# EasyEDA Pro project EasyEDA-Project.epro, board PCB2_4
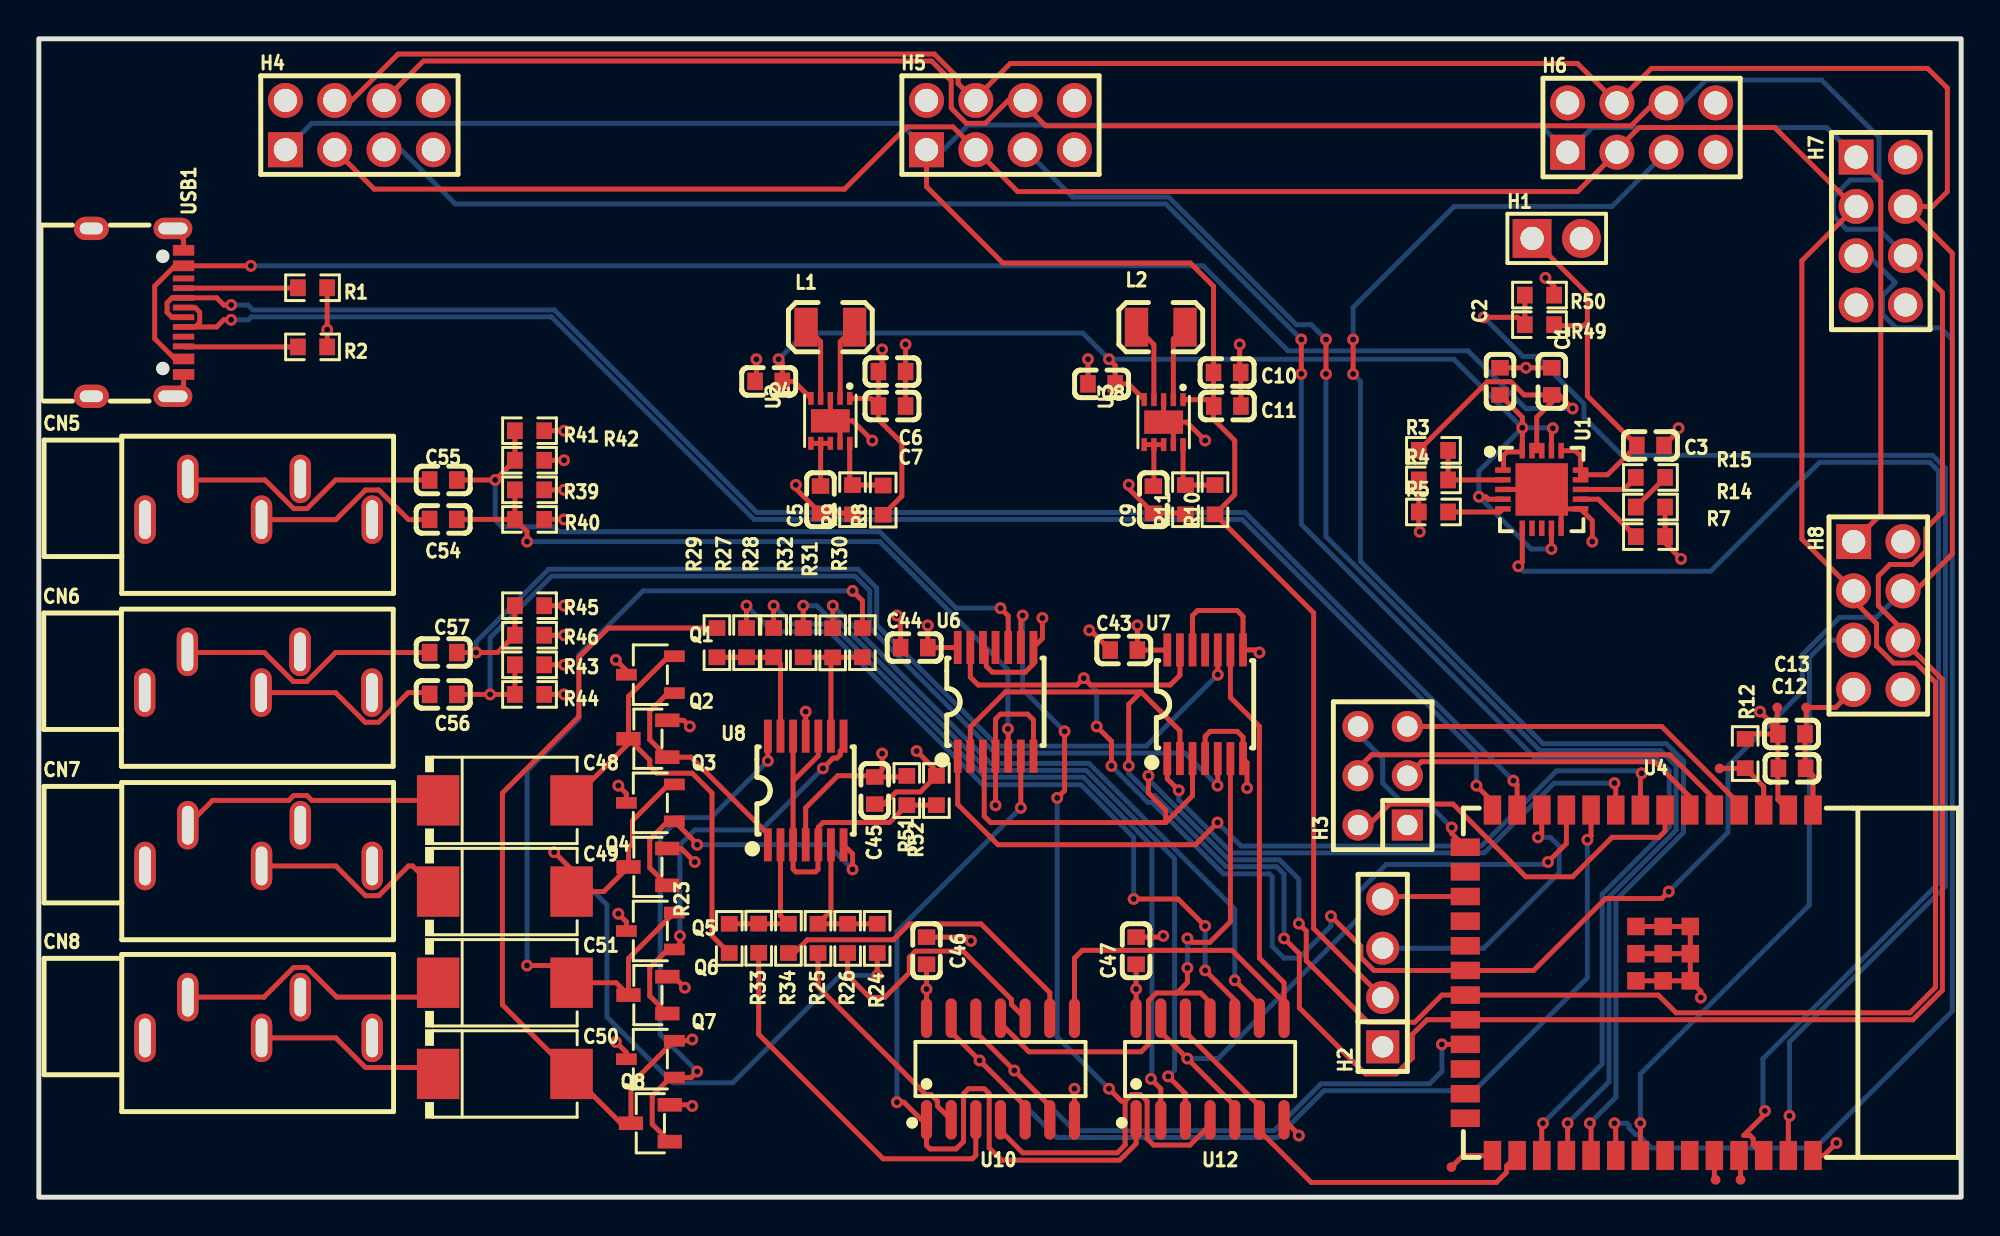
[diagram p3: board, top side]
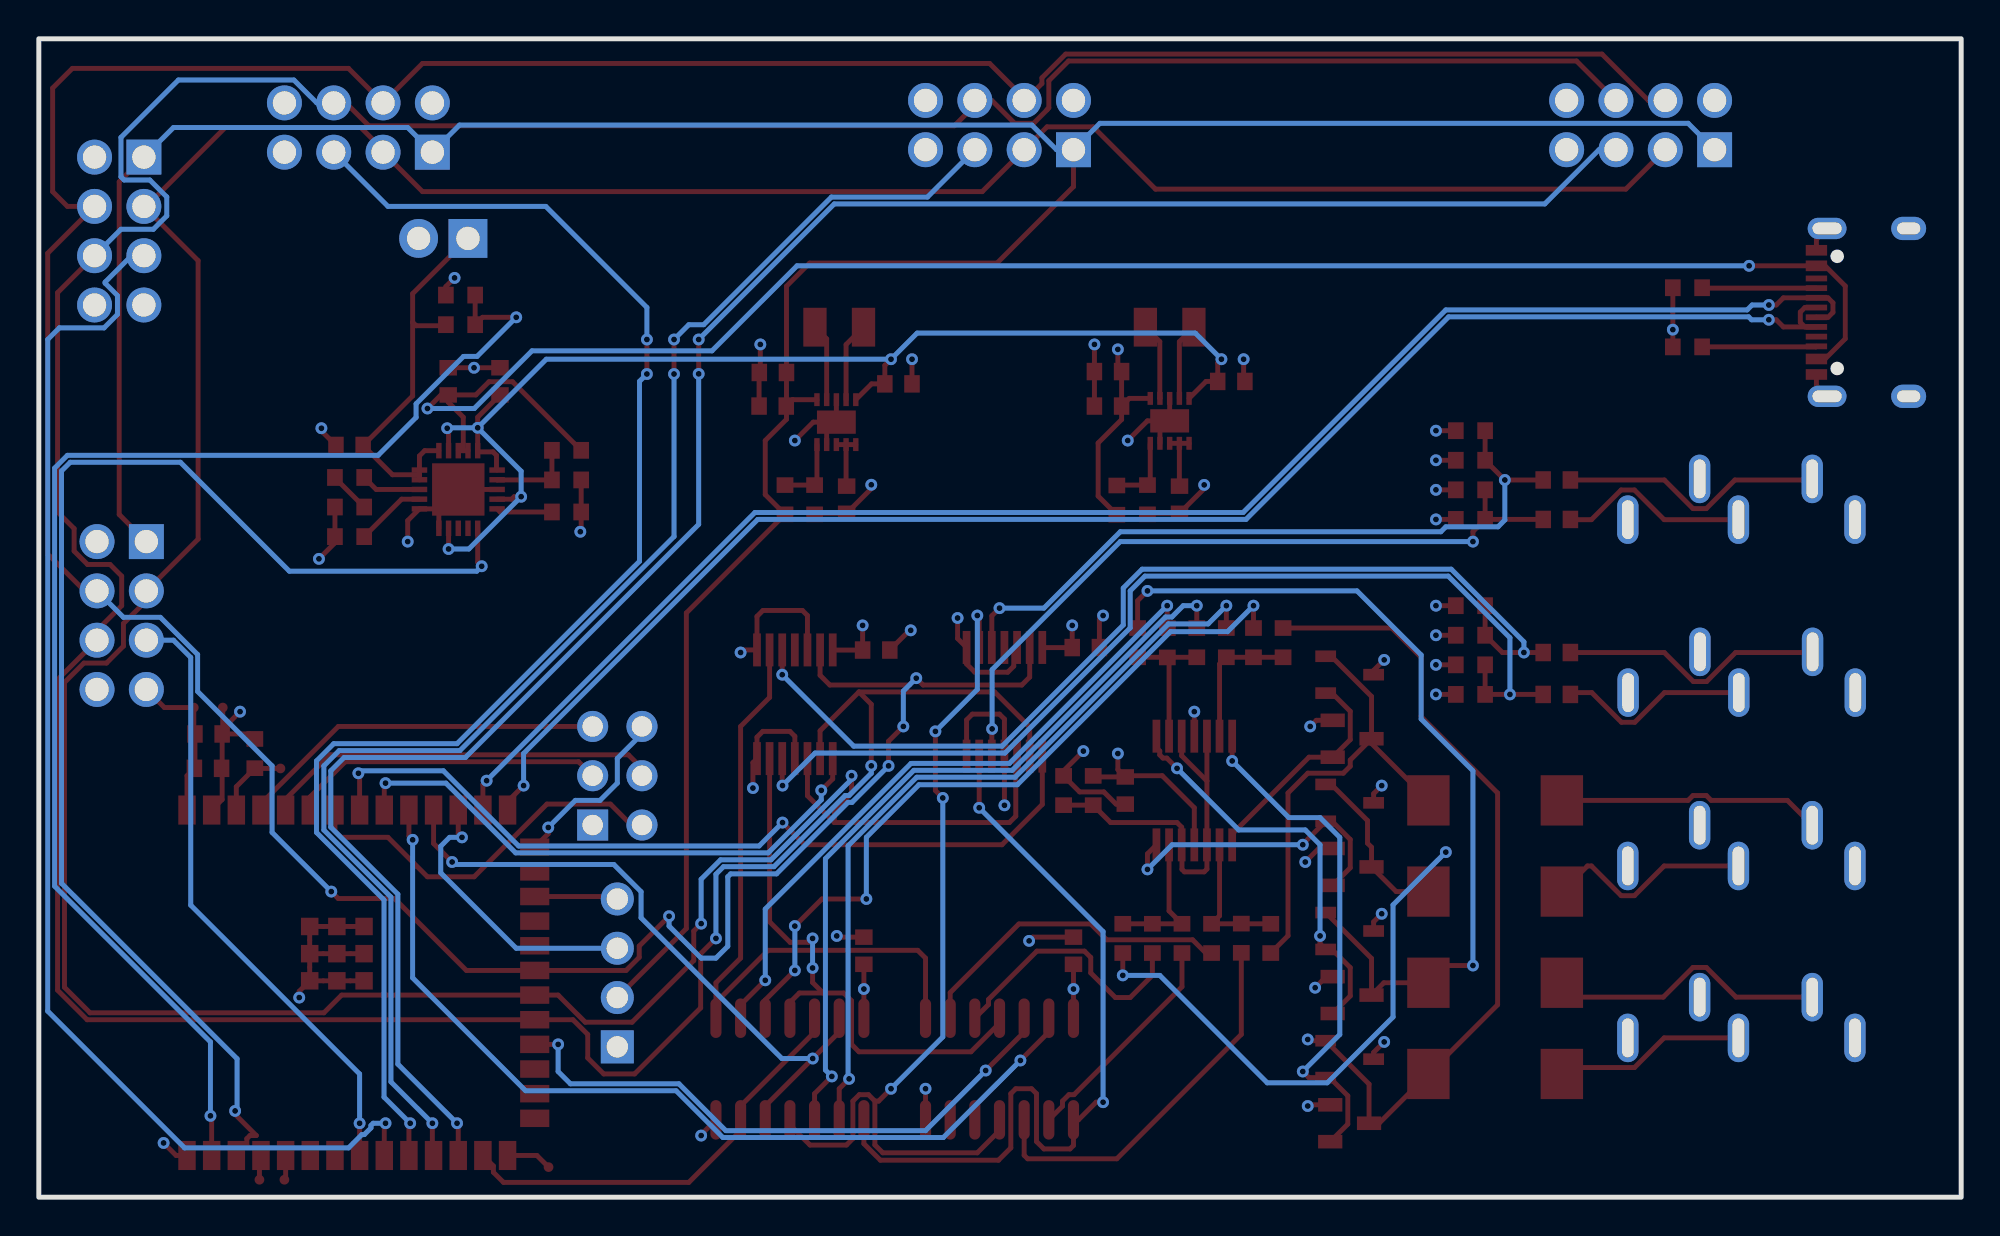
[diagram p4: board, bottom side, seen from below]

Outline 99.01 x 59.69 mm; copper layers: Top Layer, Inner1, Inner2, Bottom Layer. Coordinates in mm from the lower left corner of the outline.
Outline path: rectangle 0,59.69 99.01,0
Stack: Top Layer 0.035mm Outer layer thickness 1oz / Dielectric1 0.2104mm 7628 RC49% 8.6mil / Inner1 0.0152mm Inner layer thickness / Dielectric2 1.065mm 1.1mm H/HOZ Copper / Inner2 0.0152mm Inner layer thickness / Dielectric3 0.2104mm 7628 RC49% 8.6mil / Bottom Layer 0.035mm Outer layer thickness 1oz

## Design rules (mm)
template: JLCPCB Capability(Two Layers Board)
spacing copperThickness1oz (default): track to track 0.102, other pairs 0.152 to 0.3
spacing copperThickness2oz: track to track 0.203, other pairs 0.152 to 0.3
track width copperThickness1oz (default): min 0.127, default 0.254, max 2.54
track width copperThickness2oz: min 0.203, default 0.254, max 2.54
differential pair differentialPair (default): width min 0.127, default 0.254, max 2.54; gap min 0.152, default 0.152
via viaSize (default): diameter min 0.5, default 0.61, max 10; hole min 0.3, default 0.305, max 6.3

## Placement (name value [footprint] x y rotation side)
C1  10uF  [C0603]  77.93 42.04 270 top
C2  4.7uF  [C0603]  75.26 42.04 90 top
C3  4.7uF  [C0603]  83 38.74 0 top
C4  10uF  [C0603]  37.59 42.04 180 top
C5  100nF  [C0603]  40.26 35.94 270 top
C6  10uF  [C0603]  43.94 42.54 0 top
C7  10uF  [C0603]  43.94 40.77 0 top
C8  10uF  [C0603]  54.74 41.91 180 top
C9  100nF  [C0603]  57.4 35.94 270 top
C10  10uF  [C0603]  61.2 42.5 0 top
C11  10uF  [C0603]  61.21 40.77 0 top
C12  100nF  [C0603]  90.3 22.1 0 top
C13  100nF  [C0603]  90.27 23.87 0 top
C43  100nF  [C0603]  55.88 28.19 0 top
C44  100nF  [C0603]  45.09 28.32 0 top
C45  100nF  [C0603]  43.05 20.96 90 top
C46  10uF  [C0603]  45.72 12.7 90 top
C47  10uF  [C0603]  56.52 12.7 90 top
C48  470uF  [CAP-SMD_L7.3-W4.3-FD]  24 20.45 0 top
C49  470uF  [CAP-SMD_L7.3-W4.3-FD]  24 15.75 0 top
C50  470uF  [CAP-SMD_L7.3-W4.3-FD]  24 6.35 0 top
C51  470uF  [CAP-SMD_L7.3-W4.3-FD]  24 11.05 0 top
C54  10uF  [C0603]  20.83 34.93 180 top
C55  10uF  [C0603]  20.83 36.96 180 top
C56  10uF  [C0603]  20.83 25.91 180 top
C57  10uF  [C0603]  20.83 28.07 180 top
CN5  KH-PJ-325C  [AUDIO-TH_KH-PJ-325C]  11.32 35.96 0 top
CN6  KH-PJ-325C  [AUDIO-TH_KH-PJ-325C]  11.3 27.05 0 top
CN7  KH-PJ-325C  [AUDIO-TH_KH-PJ-325C]  11.32 18.12 0 top
CN8  KH-PJ-325C  [AUDIO-TH_KH-PJ-325C]  11.32 9.26 0 top
H1  PZ254V-11-02P  [HDR-TH_2P-P2.54-V-M]  78.18 49.41 0 top
H2  PZ254V-11-04P  [HDR-TH_4P-P2.54-V-M]  69.22 11.56 90 top
H3  2.54-2*3  [HDR-TH_6P-P2.54-V-R2-C3-S2.54_A2541WV-2X3P]  69.22 21.72 90 top
H4  A2541WV-2x4P  [HDR-TH_8P-P2.54-V-R2-C4-S2.54_A2541WV-2X4P]  16.51 55.25 0 top
H5  A2541WV-2x4P  [HDR-TH_8P-P2.54-V-R2-C4-S2.54_A2541WV-2X4P]  49.53 55.25 0 top
H6  A2541WV-2x4P  [HDR-TH_8P-P2.54-V-R2-C4-S2.54_A2541WV-2X4P]  82.55 55.12 0 top
H7  A2541WV-2x4P  [HDR-TH_8P-P2.54-V-R2-C4-S2.54_A2541WV-2X4P]  94.87 49.78 270 top
H8  A2541WV-2x4P  [HDR-TH_8P-P2.54-V-R2-C4-S2.54_A2541WV-2X4P]  94.74 29.97 270 top
L1  1.5uH  [L1207]  40.77 44.83 0 top
L2  1.5uH  [L1207]  57.78 44.83 0 top
Q1  MMBT2222A  [SOT-23-3_L2.9-W1.6-P1.90-LS2.8-BR]  31.5 26.92 0 top
Q2  MMBT2907A  [SOT-23-3_L2.9-W1.3-P1.90-LS2.4-BR]  31.37 23.62 0 top
Q3  MMBT2222A  [SOT-23-3_L2.9-W1.6-P1.90-LS2.8-BR]  31.5 20.32 0 top
Q4  MMBT2907A  [SOT-23-3_L2.9-W1.3-P1.90-LS2.4-BR]  31.37 17.02 0 top
Q5  MMBT2222A  [SOT-23-3_L2.9-W1.6-P1.90-LS2.8-BR]  31.5 13.72 0 top
Q6  MMBT2907A  [SOT-23-3_L2.9-W1.3-P1.90-LS2.4-BR]  31.37 10.41 0 top
Q7  MMBT2222A  [SOT-23-3_L2.9-W1.6-P1.90-LS2.8-BR]  31.5 7.11 0 top
Q8  MMBT2907A  [SOT-23-3_L2.9-W1.3-P1.90-LS2.4-BR]  31.5 3.81 0 top
R1  5.1kΩ  [R0603]  14.1 46.86 180 top
R2  5.1kΩ  [R0603]  14.1 43.82 180 top
R3  330kΩ  [R0603]  71.83 38.48 180 top
R4  110kΩ  [R0603]  71.83 36.96 0 top
R5  10kΩ  [R0603]  71.83 35.31 0 top
R7  100kΩ  [R0603]  83 34.04 180 top
R8  1.13MΩ  [R0603]  43.49 35.92 270 top
R9  200kΩ  [R0603]  41.91 35.94 90 top
R10  1.8MΩ  [R0603]  60.58 35.94 270 top
R11  200kΩ  [R0603]  59.05 35.94 90 top
R12  10kΩ  [R0603]  87.88 22.86 90 top
R14  1kΩ  [R0603]  83 35.56 180 top
R15  1kΩ  [R0603]  83 37.09 180 top
R23  1kΩ  [R0603]  35.56 13.34 270 top
R24  1kΩ  [R0603]  43.18 13.34 270 top
R25  1kΩ  [R0603]  40.13 13.34 90 top
R26  1kΩ  [R0603]  41.66 13.34 90 top
R27  1kΩ  [R0603]  36.45 28.58 270 top
R28  1kΩ  [R0603]  37.85 28.58 270 top
R29  1kΩ  [R0603]  34.93 28.58 90 top
R30  1kΩ  [R0603]  42.42 28.58 90 top
R31  1kΩ  [R0603]  40.89 28.57 270 top
R32  1kΩ  [R0603]  39.37 28.58 270 top
R33  1kΩ  [R0603]  37.08 13.34 90 top
R34  1kΩ  [R0603]  38.61 13.34 90 top
R39  10kΩ  [R0603]  25.27 36.45 0 top
R40  10kΩ  [R0603]  25.27 34.93 180 top
R41  10kΩ  [R0603]  25.27 39.5 0 top
R42  10kΩ  [R0603]  25.27 37.97 180 top
R43  10kΩ  [R0603]  25.27 27.43 0 top
R44  10kΩ  [R0603]  25.27 25.91 180 top
R45  10kΩ  [R0603]  25.27 30.48 0 top
R46  10kΩ  [R0603]  25.27 28.96 180 top
R49  1kΩ  [R0603]  77.29 44.96 0 top
R50  1kΩ  [R0603]  77.29 46.48 180 top
R51  1kΩ  [R0603]  44.7 20.96 90 top
R52  1kΩ  [R0603]  46.23 20.96 270 top
TP1  -  [Test-Point-0.5mm]  86.57 22.09 0 top
TP2  -  [Test-Point-0.5mm]  72.76 1.55 0 top
TP3  -  [Test-Point-0.5mm]  87.65 0.9 0 top
TP4  -  [Test-Point-0.5mm]  86.36 0.9 0 top
TP5  -  [Test-Point-0.5mm]  89.54 25.23 0 top
TP6  -  [Test-Point-0.5mm]  91.03 25.23 0 top
U1  MCP73871-2CAI/ML  [QFN-20_L4.0-W4.0-P0.50-BL-EP2.7]  77.41 36.47 270 top
U2  TPS63030DSKTG4  [SON-10_L2.5-W2.5-P0.50-TL-EP]  40.77 40 270 top
U3  TPS63030DSKTG4  [SON-10_L2.5-W2.5-P0.50-TL-EP]  57.93 39.94 270 top
U4  ESP32-S3-WROOM-1-N4  [WIFIM-SMD_ESP32-S3-WROOM-1-N8]  82.42 11.05 270 top
U6  MCP4261-103E/ST  [TSSOP-14_L5.0-W4.4-P0.65-LS6.4-BL]  49.28 25.53 0 top
U7  MCP4261-103E/ST  [TSSOP-14_L5.0-W4.4-P0.65-LS6.4-BL]  60.07 25.4 0 top
U8  LMV324IPWRE4  [TSSOP-14_L5.0-W4.4-P0.65-LS6.4-BL]  39.5 20.96 0 top
U10  74VHC4066M  [SOIC-14_L8.7-W3.9-P1.27-LS6.0-BL]  49.53 6.6 0 top
U12  74VHC4066M  [SOIC-14_L8.7-W3.9-P1.27-LS6.0-BL]  60.32 6.6 0 top
USB1  TYPE-C 16PIN 2MD(073)  [USB-C-SMD_TYPE-C-6PIN-2MD-073]  5.08 45.59 270 top

## Footprints (pads in the part's own frame, mm; a bottom-side part is the same pattern mirrored in y, then rotated)
AUDIO-TH_KH-PJ-325C
  oval 1.1x2.5 hole 0.6x2: 1(-5.85,-1.05) 2(0.15,-1.05) 3(2.15,1.05) 4(5.85,-1.05) 5(-3.65,1.05)
C0603
  rect 0.8x0.9 smd: 1(-0.7,0) 2(0.7,0)
CAP-SMD_L7.3-W4.3-FD
  rect 2.185x2.592 smd: 1(-3.437,0) 2(3.437,0)
HDR-TH_2P-P2.54-V-M
  rect 2x2 hole 1.2: 1(-1.27,0)
  round 2 hole 1.2: 2(1.27,0)
HDR-TH_4P-P2.54-V-M
  rect 1.7x1.7 hole 1.1: 1(-3.81,0)
  round 1.7 hole 1.1: 2(-1.27,0) 3(1.27,0) 4(3.81,0)
HDR-TH_6P-P2.54-V-R2-C3-S2.54_A2541WV-2X3P
  rect 1.6x1.6 hole 1.05: 1(-2.54,-1.27)
  round 1.6 hole 1.05: 2(-2.54,1.27) 3(0,-1.27) 4(0,1.27) 5(2.54,-1.27) 6(2.54,1.27)
HDR-TH_8P-P2.54-V-R2-C4-S2.54_A2541WV-2X4P
  rect 1.8x1.8 hole 1.2: 1(-3.81,-1.27)
  round 1.8 hole 1.2: 2(-3.81,1.27) 3(-1.27,-1.27) 4(-1.27,1.27) 5(1.27,-1.27) 6(1.27,1.27) 7(3.81,-1.27) 8(3.81,1.27)
L1207
  rect 1.2x2 smd: 1(-1.25,0) 2(1.25,0)
QFN-20_L4.0-W4.0-P0.50-BL-EP2.7
  rect 0.28x0.8 smd: 1(-1,-2) 2(-0.5,-2) 3(0,-2) 4(0.5,-2) 5(1,-2) 11(1,2) 12(0.5,2) 13(0,2) 14(-0.5,2) 15(-1,2)
  rect 0.8x0.28 smd: 6(2,-1) 7(2,-0.5) 8(2,0) 9(2,0.5) 10(2,1) 16(-2,1) 17(-2,0.5) 18(-2,0) 19(-2,-0.5) 20(-2,-1)
  rect 2.7x2.7 smd: 21(0,0)
R0603
  rect 0.806x0.864 smd: 1(-0.753,0) 2(0.753,0)
SOIC-14_L8.7-W3.9-P1.27-LS6.0-BL
  oval 0.574x2.038 smd: 1(-3.81,-2.619) 2(-2.54,-2.619) 3(-1.27,-2.619) 4(0,-2.619) 5(1.27,-2.619) 6(2.54,-2.619) 7(3.81,-2.619) 8(3.81,2.619) 9(2.54,2.619) 10(1.27,2.619) 11(0,2.619) 12(-1.27,2.619) 13(-2.54,2.619) 14(-3.81,2.619)
SON-10_L2.5-W2.5-P0.50-TL-EP
  rect 0.665x0.28 smd: 1(-1.157,1) 2(-1.157,0.5) 3(-1.157,0) 4(-1.157,-0.5) 5(-1.157,-1) 6(1.157,-1) 7(1.157,-0.5) 8(1.157,0) 9(1.157,0.5) 10(1.157,1)
  rect 1.2x2 smd: 11(0,0)
SOT-23-3_L2.9-W1.3-P1.90-LS2.4-BR
  rect 1.25x0.7 smd: 1(1,-0.95) 2(1,0.95) 3(-1,0)
SOT-23-3_L2.9-W1.6-P1.90-LS2.8-BR
  rect 1.07x0.6 smd: 1(1.235,-0.95) 2(1.235,0.95) 3(-1.235,0)
Test-Point-0.5mm
  round 0.5 smd: 1(0,0)
TSSOP-14_L5.0-W4.4-P0.65-LS6.4-BL
  rect 0.4x1.7 smd: 1(-1.95,-2.8) 2(-1.3,-2.8) 3(-0.65,-2.8) 4(0,-2.8) 5(0.65,-2.8) 6(1.3,-2.8) 7(1.95,-2.8) 8(1.95,2.8) 9(1.3,2.8) 10(0.65,2.8) 11(0,2.8) 12(-0.65,2.8) 13(-1.3,2.8) 14(-1.95,2.8)
USB-C-SMD_TYPE-C-6PIN-2MD-073
  rect 0.55x1.1 smd: 1(-3.2,2.375) 2(-2.4,2.375) 11(2.4,2.375) 12(3.2,2.375)
  rect 0.3x1.1 smd: 3(-1.75,2.375) 4(-1.25,2.375) 5(-0.75,2.375) 6(-0.25,2.375) 7(0.25,2.375) 8(0.75,2.375) 9(1.25,2.375) 10(1.75,2.375)
  oval 1.1x2 hole 0.6x1.5: 13(-4.325,1.825) 14(4.325,1.825)
  oval 1.2x1.8 hole 0.6x1.2: 13(-4.325,-2.375) 14(4.325,-2.375)
WIFIM-SMD_ESP32-S3-WROOM-1-N8
  rect 1.5x0.9 smd: 1(-8.9,8.954) 2(-8.9,7.684) 3(-8.9,6.415) 4(-8.9,5.144) 5(-8.9,3.874) 6(-8.9,2.604) 7(-8.9,1.335) 8(-8.9,0.065) 9(-8.9,-1.206) 10(-8.9,-2.475) 11(-8.9,-3.745) 12(-8.9,-5.016) 13(-8.9,-6.285) 14(-8.9,-7.556) 27(8.9,-7.556) 28(8.9,-6.285) 29(8.9,-5.016) 30(8.9,-3.745) 31(8.9,-2.475) 32(8.9,-1.206) 33(8.9,0.065) 34(8.9,1.335) 35(8.9,2.604) 36(8.9,3.874) 37(8.9,5.144) 38(8.9,6.415) 39(8.9,7.684) 40(8.9,8.954)
  rect 0.9x1.5 smd: 15(-6.985,-8.954) 16(-5.715,-8.954) 17(-4.445,-8.954) 18(-3.175,-8.954) 19(-1.905,-8.954) 20(-0.635,-8.954) 21(0.635,-8.954) 22(1.905,-8.954) 23(3.175,-8.954) 24(4.445,-8.954) 25(5.715,-8.954) 26(6.985,-8.954)
  rect 0.9x0.9 smd: 41(-2.9,2.635) 41(-2.9,1.235) 41(-2.9,-0.165) 41(-1.5,2.635) 41(-1.5,1.235) 41(-1.5,-0.165) 41(-0.1,2.635) 41(-0.1,1.235) 41(-0.1,-0.165)

## Nets
As in the schematic.

Pads without a net: CN5 3 4; CN6 3 4; CN7 3 4; CN8 3 4; U1 7 8; U4 16 18 19 24 25 26 34 35; U6 11; U7 11; USB1 3 9

## Via types
v1: diameter 0.61, hole 0.305, Top Layer to Bottom Layer, 137 vias

## Routing (per net, layer and track width the routed paths; a pad name or vN(x,y) marks a point on that pad's centre or on a via; arc(x,y) is an arc through that point)
3V3: length 48.3
  Top Layer w0.254: U12.14 v1(56.52,10.73) C47.1 ; TP5.1 89.54,24.13 ; 89.54,24.13 89.57,24.1 C13.1 ; 89.54,24.13 v1(88.65,25.02) ; 47.33,28.33 47.32,28.32 C44.2 v1(45.78,29.46) ; Q3.3 30.26,20.79 v1(29.84,21.21) ; C7.1 42.85,41.16 U2.1 ; C7.1 43.24,40.07 44.45,38.86 44.45,36.13 R8.2 ; C7.1 C6.1 43.43,42.74 v1(43.43,43.69) ; v1(56.58,29.46) 56.58,28.19 58.12,28.19 U7.14 ; C13.1 88.14,23.87 R12.2 ; C13.1 89.57,20.49 U4.2 ; R51.2 44.65,21.66 C45.2 ; R39.2 v1(27.05,36.45) ; R45.2 v1(27.05,30.48) ; U8.4 39.5,20.07 41.15,21.72 42.99,21.72 C45.2 ; Q1.3 30.26,27.14 v1(29.72,27.69) ; Q7.3 30.26,7.46 v1(29.72,8) ; v1(43.43,22.86) 43.43,22.04 C45.2 ; U10.14 v1(45.72,10.73) C46.1 ; R41.2 v1(27.05,39.5) ; v1(29.84,14.61) 30.26,14.19 Q5.3 ; R43.2 v1(27.05,27.43)
5V: length 166.8
  Top Layer w0.254: U3.1 60.18,41.09 60.5,40.78 ; H7.1 94.87,52.32 94.87,35.18 93.47,33.78 ; H2.2 65.66,13.84 65.66,30.11 R10.2 61.59,36.2 61.59,38.99 60.5,40.08 60.5,40.78 ; 60.5,40.78 C11.1 ; 60.5,40.78 C10.1 60.5,46.94 59.31,48.13 49.66,48.13 45.72,52.07 H5.1
  Bottom Layer w0.254: H7.1 92.07,55.12 80.01,55.12 78.74,53.85 77.34,55.25 47.86,55.25 46.59,53.98 H5.1 44.36,55.34 14.06,55.34 H4.1
GND: length 124.7
  Top Layer w0.254: v1(56.13,36.71) 56.13,36.51 C9.2 59,35.24 R11.1 ; U3.11 59.12,39.94 v1(60.07,38.99) ; U3.11 58.43,39.44 U3.9 ; U3.11 U3.3 ; C3.2 84.46,39.49 v1(84.46,39.62) ; U1.3 U1.21 ; USB1.14 7.45,41.82 USB1.12 ; R4.1 R5.1 71.08,34.33 v1(71.12,34.29) ; U2.11 41.27,39.5 U2.9 ; U2.11 U2.3 ; U2.11 41.91,40 v1(42.93,38.99) ; U4.41 U4.41 ; U4.41 U4.41 U4.41 ; U4.41 U4.41 U4.41 U4.41 ; U7.12 59.42,29.97 59.68,30.23 61.71,30.23 62.02,29.93 U7.8 62.73,28.2 v1(62.87,28.07) ; v1(84.58,32.89) 83.76,33.72 83.76,35.56 ; C46.2 47.81,13.4 v1(48.01,13.21) ; C7.2 C6.2 v1(44.64,43.94) ; U8.11 v1(39.5,25.02) ; U4.1 91.38,21.72 C12.2 90.97,22.13 C13.2 91.03,23.93 TP6.1 92.54,25.23 93.47,26.16 ; 32.37,11.36 32.71,11.36 v1(33.27,10.8) ; USB1.1 7.45,49.37 USB1.13 ; U6.12 48.8,28.16 48.8,27.36 49.11,27.05 50.8,27.05 51.23,27.48 U6.8 51.69,28.79 v1(51.69,29.84) ; v1(33.78,17.27) 33.09,17.97 Q4.2 ; C2.2 v1(76.59,42.74) C1.1 ; U4.40 91.94,2.15 v1(92.58,2.79) ; U4.41 85.6,10.61 v1(85.6,10.29) ; U4.41 U4.41 U4.41 ; v1(38.99,36.7) 38.99,36.51 C5.2 41.86,35.24 R9.1 ; R2.1 v1(14.85,44.7) R1.1 ; C11.2 61.91,42.48 C10.2 61.85,42.55 v1(61.85,43.94) ; U6.7 51.23,24.59 50.93,24.89 49.53,24.89 49.28,24.64 U6.4 v1(49.28,20.19) ; v1(64.9,3.18) 64.9,3.22 U12.7 ; v1(33.53,24.26) 33.21,24.57 Q2.2 ; C47.2 57.85,13.4 v1(57.91,13.46) ; C8.2 v1(54.04,43.18) ; Q8.2 33.59,4.76 v1(33.66,4.7) ; R40.1 v1(27.05,34.93) ; C44.1 44.38,29.78 v1(44.2,29.97) ; C4.2 36.96,42.1 v1(36.96,43.18) ; v1(45.21,22.99) 46.23,21.97 R52.1 45.4,20.88 44.16,20.88 43.53,20.26 C45.1 ; U10.7 v1(53.34,5.59) ; R44.1 v1(27.05,25.91) ; U7.4 60.07,23.75 60.32,24 61.72,24 62.02,23.7 U7.7 62.23,22.39 v1(62.23,21.08) ; R46.1 v1(27.05,28.96) ; v1(77.6,47.37) 78.04,46.93 R50.1 ; C43.1 54.16,29.21 v1(54.1,29.21) ; R42.1 v1(27.05,37.97) ; v1(80.01,33.78) 80.01,34.86 U1.11 78.41,35.47 U1.10
VBAT: length 20.6
  Top Layer w0.254: 79.41,37.23 80.79,37.23 C3.1 79.76,41.29 79.76,45.09 ; 79.41,37.23 U1.14 ; 79.41,37.23 U1.15 79.41,38.2 79.13,38.47 U1.16 ; R49.2 78.1,44.91 79.58,44.91 79.76,45.09 ; 79.76,45.09 79.76,46.56 H1.1
VBAT_SENSE: length 70
  Top Layer w0.254: R50.2 R49.1 76.16,45.34 v1(74.42,45.34) ; U4.39 90.11,4.13 v1(90.17,4.19)
  Bottom Layer w0.254: v1(74.42,45.34) 76.44,43.32 77.14,43.32 79.58,40.88 79.58,40.18 81.53,38.23 97.54,38.23 98.2,37.57 98.2,16.03 90.17,8 v1(90.17,4.19)
VBUS: length 94.8
  Top Layer w0.254: C1.2 76.5,41.34 75.82,42.02 74.61,42.02 R3.2 ; C1.2 78.29,41.34 v1(78.99,40.64) ; C1.2 77.93,40.97 77.15,40.19 77.15,38.47 ; USB1.11 7.01,43.19 5.97,44.23 5.97,46.95 7.04,48.03 7.42,48.03 USB1.2 v1(10.92,47.99) ; 77.15,38.47 U1.18 ; 77.15,38.47 U1.19
  Bottom Layer w0.254: v1(10.92,47.99) 59.96,47.99 64.34,43.61 73.61,43.61 76.58,40.64 v1(78.99,40.64)
CLK: length 210
  Top Layer w0.254: v1(64.13,13.34) 64.92,12.55 64.92,9.75 68.33,6.35 69.91,6.35 70.74,7.18 70.74,8.39 71.5,9.14 U4.22 96.52,9.14 98.04,10.67 98.04,26.67 H8.6 96.01,29.21 94.74,30.48 94.74,32 95.34,32.6 96.5,32.6 97.19,33.29 97.19,34.45 98.04,35.31 98.04,46.61 H7.6 ; H4.6 19.81,58.55 45.97,58.55 46.99,57.53 46.99,56.13 47.08,56.04 47.08,56.03 47.77,55.34 48.75,55.34 49.93,56.52 H5.6 50.8,56.26 51.85,55.21 82.01,55.21 83.19,56.39 H6.6 ; U6.2 47.98,24.23 49.78,26.04 56.77,26.04 ; 56.77,26.04 56.13,25.4 v1(56.13,22.23) ; 56.77,26.04 58.77,24.03 U7.2
  Bottom Layer w0.254: H6.6 84.69,56.39 85.87,57.57 91.82,57.57 94.78,54.61 94.78,52.58 94.61,52.42 93.29,52.42 92.42,51.54 92.42,50.57 93.11,49.88 94.78,49.88 H7.6 ; v1(64.13,13.34) 64.13,16.64 63.75,17.03 61.15,17.03 57.48,20.7 57.28,20.7 56.13,21.84 v1(56.13,22.23)
CS1: length 107.6
  Top Layer w0.254: v1(65.02,44.2) v1(65.02,42.43) ; v1(77.47,3.81) 77.41,3.75 U4.29
  Bottom Layer w0.254: v1(65.02,42.43) 65.02,34.67 77.04,22.66 83.29,22.66 83.97,21.97 83.97,19.07 80.52,15.61 80.52,6.86 v1(77.47,3.81) ; v1(65.02,44.2) 58.04,51.18 21.45,51.18 18.65,53.98 H4.5
CS2: length 75
  Top Layer w0.254: v1(78.74,3.81) 78.74,2.21 U4.30 ; v1(66.29,44.2) v1(66.29,42.42)
  Bottom Layer w0.254: v1(66.29,42.42) 66.29,34.04 77.32,23.01 83.54,23.01 84.33,22.23 84.33,18.92 80.87,15.46 80.87,5.94 v1(78.74,3.81) ; H5.5 53.24,51.54 58.19,51.54 64.77,44.96 65.53,44.96 v1(66.29,44.2)
CS3: length 75.9
  Top Layer w0.254: v1(67.69,44.2) v1(67.69,42.42) ; v1(79.88,3.81) 79.95,3.75 U4.31
  Bottom Layer w0.254: v1(67.69,42.42) 68.07,42.04 68.07,32.77 77.47,23.37 83.82,23.37 84.71,22.48 84.71,18.8 81.23,15.32 81.23,5.16 v1(79.88,3.81) ; 83.82,53.85 81.03,51.05 72.9,51.05 67.69,45.85 v1(67.69,44.2)
CS4: length 65.8
  Top Layer w0.254: U4.32 81.22,3.75 v1(81.15,3.81)
  Bottom Layer w0.254: v1(81.15,3.81) 81.79,3.81 81.9,3.69 81.9,3.57 82.25,3.23 82.37,3.23 83.06,2.54 91.5,2.54 98.55,9.59 98.55,44.2 97.95,44.8 95.65,44.8 94.96,45.49 94.96,46.46 95.59,47.1 95.59,47.15 94.23,48.51 H7.5
CS5: length 31.9
  Top Layer w0.254: U4.33 v1(82.49,3.81)
  Bottom Layer w0.254: 93.47,28.7 92.07,28.7 91.19,27.81 91.19,15.05 82.49,6.35 v1(82.49,3.81)
CTRL_IN1_OUT1: length 51.9
  Top Layer w0.254: U4.10 79.95,18.61 v1(79.76,18.42) ; U10.5 50.8,4.7 v1(48.45,7.05) 46.99,8.51 U10.13
  Bottom Layer w0.254: v1(48.45,7.05) 52.43,3.07 63.77,3.07 66.19,5.49 73.94,5.49 79.76,11.3 v1(79.76,18.42)
CTRL_IN1_OUT2: length 33.4
  Top Layer w0.254: v1(77.72,17.27) 78.68,18.23 U4.11 ; U12.5 61.59,4.7 v1(59.15,7.14) 57.78,8.51 U12.13
  Bottom Layer w0.254: v1(77.72,17.27) 77.6,17.15 69.4,17.15 67.99,15.74 67.99,14.4 60.74,7.14 v1(59.15,7.14)
CTRL_IN2_OUT1: length 34
  Top Layer w0.254: U10.6 52.07,4.7 v1(50.24,6.53) 48.26,8.51 U10.12 ; U4.23 v1(72.26,7.87)
  Bottom Layer w0.254: v1(50.24,6.53) 53.34,3.43 63.63,3.43 66.04,5.84 71.63,5.84 72.26,6.48 v1(72.26,7.87)
CTRL_IN2_OUT2: length 22.5
  Top Layer w0.254: U4.28 75.6,1.61 75.6,1.28 75.07,0.76 65.53,0.76 62.87,3.43 U12.6 62.87,4.7 59.06,8.51 U12.12
DOWN: length 20.5
  Top Layer w0.254: H3.4 67.94,22.1 68.64,22.8 84.01,22.8 86.3,20.51 U4.5
ENTER: length 9.3
  Top Layer w0.254: U4.15 72.77,18.73 v1(72.77,19.05)
  Bottom Layer w0.254: v1(72.77,19.05) 71.37,20.45 70.1,20.45 69.22,21.34 69.22,22.61 67.94,23.88 H3.6
IJACK1_L: length 13.7
  Top Layer w0.254: C55.2 15.29,36.96 13.81,35.48 13.13,35.48 11.65,36.96 7.73,36.96 CN5.5
IJACK1_R: length 9.9
  Top Layer w0.254: 11.47,34.91 15.3,34.91 16.83,36.44 17.51,36.44 19.04,34.91 20.11,34.91 C54.2
IJACK2_L: length 13.7
  Top Layer w0.254: C57.2 15.29,28.07 13.8,26.57 13.11,26.57 11.61,28.07 7.69,28.07 CN6.5
IJACK2_R: length 10
  Top Layer w0.254: CN6.2 15.28,26 16.81,24.47 17.5,24.47 19.03,26 20.03,26 C56.2
IN1_L: length 37.1
  Top Layer w0.254: v1(49.53,30.35) 49.93,29.96 49.93,28.33 ; C55.1 v1(23.5,36.96) R42.2 R41.1
  Bottom Layer w0.254: v1(49.53,30.35) 47.24,30.35 43.31,34.29 26.8,34.29 26.54,34.54 23.85,34.54 23.5,34.89 v1(23.5,36.96)
IN1_L_SW1: length 19.9
  Top Layer w0.254: U10.3 48.26,2.16 48.08,1.98 43.49,1.98 37.08,8.39 R33.1
IN1_L_SW2: length 39.6
  Top Layer w0.254: U12.3 59.06,5.33 v1(58.17,6.22) ; R32.1 v1(39.37,30.48)
  Bottom Layer w0.254: v1(39.37,30.48) 40.07,30.48 40.65,29.9 40.97,29.9 48.87,22 53.94,22 58.5,17.44 58.5,6.55 v1(58.17,6.22)
IN1_POTOUT_L: length 46.6
  Top Layer w0.254: v1(52.83,24) 52.83,20.96 v1(52.45,20.57) ; U10.4 49.53,3.43 50.67,2.29 55.54,2.29 55.95,2.69 55.95,4.95 ; 55.95,4.95 56.28,5.28 56.75,5.28 57.08,4.95 57.08,3.02 57.41,2.69 59.29,2.69 60.32,3.72 U12.4 ; 55.95,4.95 55.75,4.95 v1(55.12,5.59) ; v1(50.67,29.97) 50.58,29.88 U6.9
  Bottom Layer w0.254: v1(50.67,29.97) 50.67,26.16 v1(52.83,24) ; v1(52.45,20.57) 52.45,8.25 v1(55.12,5.59)
IN1_POTOUT_R: length 42
  Top Layer w0.254: v1(44.2,4.89) 44.56,4.89 45.46,3.99 U10.1 45.72,2.67 45.9,2.49 47.24,2.49 47.62,2.87 47.62,5.33 47.88,5.59 48.69,5.59 48.95,5.33 48.95,2.54 49.58,1.91 55.66,1.91 56.52,2.76 U12.1 ; U6.6 v1(50.58,20.07)
  Bottom Layer w0.254: v1(50.58,20.07) 44.2,13.69 v1(44.2,4.89)
IN1_R: length 37.9
  Top Layer w0.254: R40.2 C54.1 ; R40.2 25.15,34.3 v1(25.15,33.78) ; R40.2 R39.1 ; 49.93,22.73 49.93,24.12 v1(49.91,24.13)
  Bottom Layer w0.254: v1(49.91,24.13) 49.91,27.18 43.31,33.78 v1(25.15,33.78)
IN1_R_SW1: length 11.6
  Top Layer w0.254: R25.1 40.13,10.84 45.69,5.28 45.95,5.28 46.29,4.95 46.29,4.69 U10.2
IN1_R_SW2: length 40.1
  Top Layer w0.254: U12.2 57.78,5.59 v1(57.28,6.1) ; R28.1 v1(37.85,30.48)
  Bottom Layer w0.254: v1(37.85,30.48) 38.79,29.54 40.83,29.54 48.73,21.64 53.79,21.64 57.33,18.11 57.33,6.15 v1(57.28,6.1)
IN2_L: length 52.9
  Top Layer w0.254: U7.10 v1(60.72,26.92) ; R45.1 R46.2 23.63,28.07 v1(22.52,28.07) C57.1
  Bottom Layer w0.254: v1(60.72,26.92) 57.04,23.24 49.4,23.24 43.16,29.48 43.16,31.39 42.18,32.36 26.26,32.36 22.52,28.62 v1(22.52,28.07)
IN2_L_SW1: length 16.9
  Top Layer w0.254: R34.1 38.9,12.58 39.58,13.26 44.01,13.26 44.83,14.08 48.53,14.08 52.07,10.54 U10.9
IN2_L_SW2: length 34.5
  Top Layer w0.254: U12.9 62.87,9.91 v1(61.59,11.18) ; v1(40.89,30.48) 40.89,29.33 R31.1
  Bottom Layer w0.254: v1(40.89,30.48) 49.02,22.35 54.09,22.35 61.59,14.85 v1(61.59,11.18)
IN2_POTOUT_L: length 35.3
  Top Layer w0.254: 64.13,10.03 U12.8 ; 64.13,10.03 61.45,12.72 53.74,12.72 53.34,12.32 U10.8 ; 64.13,10.03 64.13,11.05 62.87,12.32 62.87,24.26 61.37,25.75 U7.9
IN2_POTOUT_R: length 29.4
  Top Layer w0.254: v1(59.16,11.81) 59.16,11.06 58.61,10.52 ; 58.61,10.52 57.55,10.52 57.15,10.12 57.15,7.87 56.77,7.49 51,7.49 49.53,8.96 U10.11 ; 58.61,10.52 59.84,10.52 60.32,10.03 U12.11 ; v1(59.16,13.34) 59.36,13.13 60.31,13.13 61.37,14.19 U7.6
  Bottom Layer w0.254: v1(59.16,13.34) v1(59.16,11.81)
IN2_R: length 53.2
  Top Layer w0.254: U7.5 60.72,21.22 v1(60.71,21.21) ; C56.1 v1(23.24,25.91) R44.2 R43.1
  Bottom Layer w0.254: v1(60.71,21.21) 59.03,22.89 49.25,22.89 42.8,29.34 42.8,31.24 42.04,32 26.42,32 23.24,28.83 v1(23.24,25.91)
IN2_R_SW1: length 13.8
  Top Layer w0.254: U10.10 50.1,9.93 50.1,10.19 47.61,12.68 45.15,12.68 44.83,12.36 44.83,11.56 43.56,10.29 42.8,10.29 41.66,11.43 R26.1
IN2_R_SW2: length 38.9
  Top Layer w0.254: v1(60.07,13.97) 58.67,15.37 v1(56.39,15.37) ; R27.1 v1(36.45,30.48) ; U12.10 61.59,10.16 v1(60.07,11.68)
  Bottom Layer w0.254: v1(60.07,11.68) v1(60.07,13.97) ; v1(56.39,15.37) 56.39,18.54 53.68,21.25 48.61,21.25 40.72,29.14 37.79,29.14 v1(36.45,30.48)
LEFT: length 19.9
  Top Layer w0.254: U4.7 83.76,18.86 83.44,18.54 81.03,18.54 78.99,16.51 76.59,16.51 72.84,20.26 69.57,20.26 68.49,19.18 H3.2
MISO: length 198.4
  Top Layer w0.254: H8.4 96.65,31.24 98.55,33.15 98.55,48.64 H7.4 97.54,51.05 98.3,51.82 98.3,57.15 97.28,58.17 83.06,58.17 H6.4 79.25,58.42 50.04,58.42 48.26,56.64 H5.4 48.21,56.52 47.35,57.38 47.35,57.68 46.12,58.9 18.5,58.9 16.11,56.52 H4.4 ; v1(55.25,22.23) 55.25,23.5 v1(54.48,24.26) ; U7.13 58.77,26.89 58.27,26.39 54.17,26.39 v1(53.82,26.74) 53.46,26.39 48.38,26.39 47.98,26.8 U6.13 ; v1(66.55,14.48) 68.09,12.94 68.09,12.36 68.76,11.68 U4.20 76.99,11.68 80.69,15.39 83.59,15.39 v1(83.95,15.75)
  Bottom Layer w0.254: v1(83.95,15.75) 87,18.8 87,22.23 90.83,26.06 90.83,27.96 92.75,29.88 94.65,29.88 H8.4 ; v1(53.82,26.74) 54.48,26.08 v1(54.48,24.26) ; v1(66.55,14.48) 66.55,13.97 64.9,12.32 64.13,12.32 63.53,12.93 63.53,16.51 63.38,16.66 61.02,16.66 57.33,20.34 57.12,20.34 v1(55.25,22.23)
MOSI: length 198.9
  Top Layer w0.254: 58.04,19.3 58.04,19.94 57.15,20.83 v1(57.15,21.72) ; 58.04,19.3 49.02,19.3 48.69,19.63 48.69,22.66 U6.3 ; 58.04,19.3 59.42,20.69 U7.3 ; H4.3 17.27,51.94 41.49,51.94 44.7,55.15 47.08,55.15 H5.3 50.42,51.82 79.25,51.82 81.28,53.85 81.28,53.98 82.42,55.12 89.41,55.12 93.47,51.05 H7.3 90.81,48.26 90.81,33.91 93.47,31.24 93.47,30.74 94.65,29.56 94.65,28.4 95.52,27.52 96.69,27.52 97.69,26.52 97.69,10.82 96.37,9.5 84.33,9.5 83.41,10.41 U4.21 72.26,10.41 70.87,9.02 68.45,9.02 65.28,12.19 65.28,13.72 v1(64.9,14.1)
  Bottom Layer w0.254: v1(57.15,21.72) 57.15,21.53 61.29,17.39 63.89,17.39 64.9,16.38 v1(64.9,14.1)
OJACK1_L: length 13.6
  Top Layer w0.254: CN7.5 8.95,20.45 12.88,20.45 13.13,20.7 13.81,20.7 14.06,20.45 C48.1
OJACK1_R: length 10.9
  Top Layer w0.254: C49.1 19.25,17.07 19.04,17.07 17.51,15.54 16.83,15.54 15.3,17.07 11.47,17.07
OJACK2_L: length 14.5
  Top Layer w0.254: CN8.5 11.6,10.31 13.13,11.84 13.81,11.84 15.34,10.31 19.83,10.31 C51.1
OJACK2_R: length 9.9
  Top Layer w0.254: 11.47,8.21 15.3,8.21 16.83,6.68 20.24,6.68 C50.1
OUT1_L: length 24.1
  Top Layer w0.254: Q2.3 31.47,22.53 31.47,22.21 31.82,21.85 33.65,21.85 34.67,20.83 34.67,13.47 R23.2 ; Q2.3 30.37,25.8 32.44,27.87 Q1.2 ; Q2.3 30.37,23.38 C48.2
OUT1_R: length 39.6
  Top Layer w0.254: Q3.2 32.44,21.27 30.58,19.41 30.58,18.24 30.37,18.03 Q4.3 29.1,15.75 C49.2 27.44,16.88 v1(26.54,17.78) ; R24.2 v1(43.18,11.43)
  Bottom Layer w0.254: v1(43.18,11.43) 41.28,11.43 35.74,5.89 32.65,5.89 29.26,9.28 29.26,15.06 v1(26.54,17.78)
OUT2_L: length 45.8
  Top Layer w0.254: v1(25.15,11.94) 26.55,11.94 C51.2 29.73,11.05 Q6.3 30.37,12.3 Q5.2 ; R30.2 42.42,30.73 v1(41.91,31.24)
  Bottom Layer w0.254: v1(25.15,11.94) 25.15,21.97 27.81,24.64 27.81,27.94 31.12,31.24 v1(41.91,31.24)
OUT2_R: length 42.5
  Top Layer w0.254: v1(33.66,8.13) 33.59,8.06 32.73,8.06 30.5,5.83 Q8.3 29.98,3.81 C50.2 23.88,9.91 23.88,20.83 27.81,24.77 27.81,27.81 29.33,29.33 R29.2
P1_CS: length 43.1
  Top Layer w0.254: v1(82.55,21.84) 82.49,21.78 U4.8 ; v1(60.71,19.3) 59.56,18.16 49.4,18.16 47.33,20.24 47.33,22.73
  Bottom Layer w0.254: v1(60.71,19.3) 61.91,18.1 74.3,18.1 78.17,21.97 82.42,21.97 v1(82.55,21.84)
P2_CS: length 28.8
  Top Layer w0.254: U4.9 81.22,21.27 v1(81.15,21.34) ; U7.1 58.12,21.55 v1(58.71,20.96)
  Bottom Layer w0.254: v1(81.15,21.34) 78.04,21.34 74.45,17.74 61.44,17.74 58.71,20.47 v1(58.71,20.96)
REF_1V65: length 19.8
  Top Layer w0.254: R52.2 R51.1 43.81,19.3 40.39,19.3 40.15,19.07 U8.5 40.13,18.14 40.13,16.89 40,16.76 38.99,16.76 38.85,16.91 U8.3 38.85,21.45 ; 38.85,21.45 40.15,22.75 U8.10 ; 38.85,21.45 U8.12
RIGHT: length 16.3
  Top Layer w0.254: U4.6 85.03,20.64 83.22,22.44 71.21,22.44 H3.3
SCL: length 4.3
  Top Layer w0.254: U4.17 69.34,15.49 H2.4
SDA: length 14.8
  Top Layer w0.254: U4.12 77.41,18.73 v1(77.22,18.54)
  Bottom Layer w0.254: H2.3 74.42,12.83 78.31,16.71 78.31,18.09 77.85,18.54 v1(77.22,18.54)
UP: length 19.1
  Top Layer w0.254: H3.5 83.58,24.26 87.57,20.27 U4.4
USB_DM: length 82.8
  Top Layer w0.254: v1(9.91,45.97) 9.53,45.97 9.16,46.34 USB1.5 6.86,46.34 6.6,46.09 6.6,45.59 6.86,45.34 7.45,45.34 USB1.7 ; v1(75.95,21.46) 76.14,21.27 U4.13
  Bottom Layer w0.254: v1(9.91,45.97) 10.77,45.97 11.02,45.72 26.54,45.72 36.98,35.28 62.13,35.28 v1(75.95,21.46)
USB_DP: length 81.2
  Top Layer w0.254: 8.05,44.84 8.28,45.08 8.28,45.61 8.05,45.84 USB1.6 ; 8.05,44.84 9.16,44.84 9.53,45.21 v1(9.91,45.21) ; 8.05,44.84 USB1.8 ; v1(74.04,21.21) 74.87,20.38 U4.14
  Bottom Layer w0.254: v1(9.91,45.21) 10.8,45.21 10.95,45.36 26.4,45.36 36.83,34.93 61.98,34.93 74.04,22.86 v1(74.04,21.21)
USB_SENSE: length 66.4
  Top Layer w0.254: U4.38 88.3,2.69 88.3,3.02 88.13,3.18 87.81,3.18 88.9,4.27 v1(88.9,4.44) ; U1.6 76.41,32.72 v1(76.2,32.51)
  Bottom Layer w0.254: v1(76.2,32.51) 76.45,32.26 86.11,32.26 91.72,37.87 97.39,37.87 97.84,37.42 97.84,16.17 88.8,7.13 88.8,4.55 v1(88.9,4.44)
VSYS: length 66.8
  Top Layer w0.254: v1(74.17,36.09) 74.53,36.09 74.65,35.97 U1.4 ; C2.1 76.41,40.19 v1(76.41,39.65) U1.20 76.34,38.41 75.62,38.41 75.44,38.23 75.44,37.5 U1.1 ; U1.9 v1(77.91,33.4) ; v1(55.12,43.18) 55.44,42.86 55.44,41.91 56.12,41.91 U3.5 ; U2.5 38.89,42.04 C4.1 38.29,42.99 v1(38.1,43.18) ; U1.17 77.91,39.55 v1(77.98,39.62)
  Bottom Layer w0.254: v1(77.98,39.62) 77.96,39.65 v1(76.41,39.65) ; v1(38.1,43.18) 39.45,44.53 53.77,44.53 v1(55.12,43.18) 72.87,43.18 v1(76.41,39.65) ; v1(76.41,39.65) 74.17,37.41 v1(74.17,36.09) 76.86,33.4 v1(77.91,33.4)
$1N480: length 5.9
  Top Layer w0.254: R1.2 13.32,46.84 USB1.4
$1N506: length 5.9
  Top Layer w0.254: R2.2 7.48,43.82 USB1.10
$1N1632: length 4.4
  Top Layer w0.254: 72.58,38.48 72.58,36.96 75.4,36.96 U1.2
$1N1764: length 2.9
  Top Layer w0.254: U1.5 75.25,35.31 72.58,35.31
$1N1839: length 3.1
  Top Layer w0.254: R15.2 81.63,36.47 U1.13
$1N1881: length 3.6
  Top Layer w0.254: R7.2 80.32,35.97 U1.12
$1N2370: length 3.2
  Top Layer w0.254: U2.6 U2.7 ; U2.7 40.27,36.65 40.26,36.64 ; U2.7 U2.8
$1N2432: length 4
  Top Layer w0.254: U2.2 41.28,41.17 41.28,44.09 L1.2
$1N2438: length 4
  Top Layer w0.254: L1.1 40.27,44.08 U2.4
$1N2461: length 3.8
  Top Layer w0.254: U2.10 41.77,36.84 R9.2 43.47,36.69 R8.1
$1N3033: length 3.7
  Top Layer w0.254: U3.10 58.93,36.82 R11.2 R10.1
$1N3038: length 4
  Top Layer w0.254: L2.2 58.43,44.23 U3.2
$1N3051: length 3.2
  Top Layer w0.254: U3.7 57.43,36.67 57.4,36.64 ; U3.7 U3.8 ; U3.7 U3.6
$1N3063: length 4.1
  Top Layer w0.254: U3.4 57.43,43.93 L2.1
$1N4175: length 2.1
  Top Layer w0.254: R14.2 83.76,37.07 83.76,37.09
$2N491: length 2.4
  Top Layer w0.254: U4.27 73.35,2.15 TP2.1
$2N495: length 3.9
  Top Layer w0.254: TP1.1 87.87,22.09 R12.1 88.84,21.15 U4.3
$2N518: length 1.3
  Top Layer w0.254: U4.37 87.65,2.07 TP3.1
$2N539: length 1.3
  Top Layer w0.254: U4.36 86.3,0.96 TP4.1
$3N1138: length 7.3
  Top Layer w0.254: R23.1 R34.2 38.2,14.5 U8.2
$3N1139: length 7.4
  Top Layer w0.254: R24.1 R26.2 R25.2 40.8,14.75 U8.6
$3N1144: length 7.1
  Top Layer w0.254: R29.1 R27.2 R28.2 38.2,27.47 U8.13
$3N1145: length 7.1
  Top Layer w0.254: U8.9 40.8,27.72 R31.2 ; R32.2 R30.1
$3N1256: length 21.1
  Top Layer w0.254: v1(40.39,22.1) 40.91,22.63 41.11,22.63 41.28,22.79 41.28,22.99 41.45,23.16 U8.8 ; v1(33.02,13.46) 33.02,13.06 Q5.1 32.4,12.77 31.47,11.83 31.47,10.37 32.37,9.46
  Bottom Layer w0.254: v1(33.02,13.46) 33.02,18.16 33.78,18.92 37.21,18.92 v1(40.39,22.1)
$3N2308: length 11.8
  Top Layer w0.254: Q1.1 32.4,25.97 31.47,25.04 31.47,23.58 Q2.1 33.59,22.67 37.55,18.71 U8.1
$3N2351: length 16.1
  Top Layer w0.254: v1(33.91,18.16) 33.91,18.19 Q3.1 32.4,19.37 31.47,18.43 31.47,16.97 Q4.1 ; v1(41.91,16.89) 41.91,17.69 U8.7
  Bottom Layer w0.254: v1(41.91,16.89) 40.64,18.16 v1(33.91,18.16)
$3N2603: length 26.7
  Top Layer w0.254: Q8.1 31.59,3.76 31.59,5.23 32.53,6.16 Q7.1 33.59,6.16 33.78,6.35 ; U8.14 v1(37.55,22.48)
  Bottom Layer w0.254: v1(33.91,6.48) 32,8.38 32,18.54 33.02,19.56 34.63,19.56 v1(37.55,22.48)

## Copper pours and planes (outline as drawn; the poured copper is in the pictures)
3V3 on Inner2: -6.6,64.64 113.16,64.64 113.16,-6.1 -6.6,-6.1
GND on Inner1: -2.54,61.85 108.84,61.85 108.84,-3.81 -2.54,-3.81
